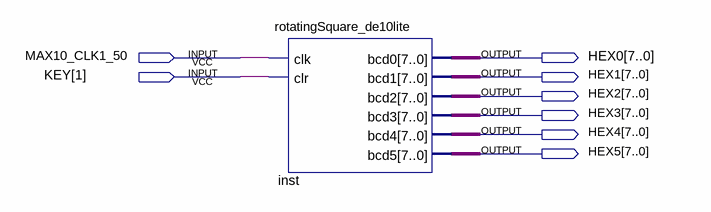
[diagram p0: schematic sheet]
// Quartus schematic RotatingSquareDe10LiteTest.bdf as structural Verilog: 1 symbols, 8 pins
module RotatingSquareDe10LiteTest (
  input  MAX10_CLK1_50,
  input  [1:1] KEY,
  output [7:0] HEX0,
  output [7:0] HEX1,
  output [7:0] HEX2,
  output [7:0] HEX3,
  output [7:0] HEX4,
  output [7:0] HEX5
);

  rotatingSquare_de10lite inst (
    .clk(MAX10_CLK1_50), .clr(KEY[1]), .bcd0(HEX0), .bcd1(HEX1), .bcd2(HEX2), .bcd3(HEX3), .bcd4(HEX4),
    .bcd5(HEX5));
endmodule
